# EAGLE design Simon-2021-Giveaway (EAGLE 9.6.2)
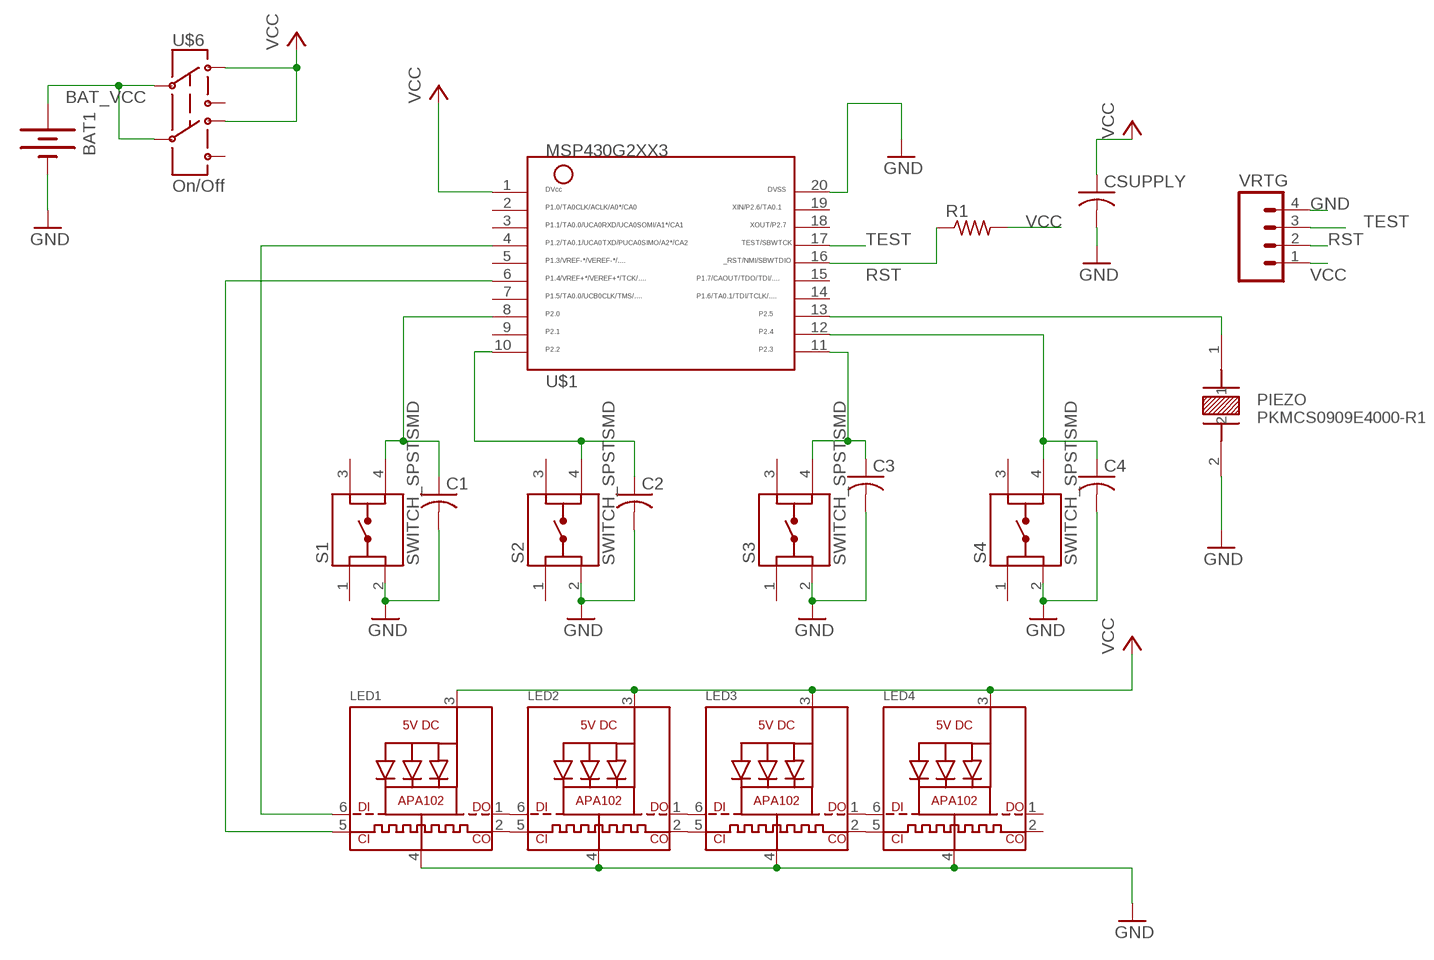
[diagram p0: schematic, sheet 1]

## Parts
BAT1  BATTERY  [BATTERY_PACK_2AA]
C1  C-USC1206  [C1206]
C2  C-USC1206  [C1206]
C3  C-USC1206  [C1206]
C4  C-USC1206  [C1206]
CSUPPLY  C-USC1206  [C1206]
LED1  APA1022020  [APA102_2020]
LED2  APA1022020  [APA102_2020]
LED3  APA1022020  [APA102_2020]
LED4  APA1022020  [APA102_2020]
PIEZO  PKMCS0909E4000-R1  [XDCR_PKMCS0909E4000-R1]
R1  R-US_R1206  [R1206]
S1  SWITCH_SPSTSMD  [SW_1571563-4]
S2  SWITCH_SPSTSMD  [SW_1571563-4]
S3  SWITCH_SPSTSMD  [SW_1571563-4]
S4  SWITCH_SPSTSMD  [SW_1571563-4]
U$1  MSP430G2XX3TSSOP  [PW20]
U$6  On/Off  SWITCH_DPDT  [JS_DPDT_TH]
VRTG  M04LOCK  [1X04_LOCK]

## Nets
BAT_VCC: BAT1.3V(+) U$6.2 U$6.5
CLK: LED1.5(CKI) U$1.6
DATA: LED1.6(DI) U$1.4
GND: BAT1.GND(-) C1.2 C2.2 C3.2 C4.2 CSUPPLY.2 LED1.4(GND) LED2.4(GND) LED3.4(GND) LED4.4(GND) PIEZO.2 S1.2 S2.2 S3.2 S4.2 U$1.20 VRTG.4
N$11: PIEZO.1 U$1.13
N$13: C1.1 S1.4 U$1.8
N$14: C2.1 S2.4 U$1.10
N$15: C3.1 S3.4 U$1.11
N$16: C4.1 S4.4 U$1.12
N$71: LED1.1(DO) LED2.6(DI)
N$72: LED1.2(CKO) LED2.5(CKI)
N$73: LED2.1(DO) LED3.6(DI)
N$74: LED2.2(CKO) LED3.5(CKI)
N$75: LED3.1(DO) LED4.6(DI)
N$76: LED3.2(CKO) LED4.5(CKI)
RST: R1.1 U$1.16 VRTG.2
TEST: U$1.17 VRTG.3
VCC: CSUPPLY.1 LED1.3(VDD) LED2.3(VDD) LED3.3(VDD) LED4.3(VDD) R1.2 U$1.1 U$6.1 U$6.4 VRTG.1
Unconnected: LED4.1(DO) LED4.2(CKO) S1.1 S1.3 S2.1 S2.3 S3.1 S3.3 S4.1 S4.3 U$1.2 U$1.3 U$1.5 U$1.7 U$1.9 U$1.14 U$1.15 U$1.18 U$1.19 U$6.3 U$6.6

## Library data of the parts
BAT1 = ELEC327:BATTERY: Battery Holders Various common sizes : AA, AAA, 20mm coin cell and 12mm coin cell. 20MM_4LEGS, BATT-10373
C1-C4 CSUPPLY = rcl:C-US: CAPACITOR, American symbol
LED1-LED4 = microbuilder:APA102: APA102/DotStar Pixels VCC: 5V DC Refresh Rate: 400Hz
PIEZO = ELEC327:PKMCS0909E4000-R1: Audio Sounder Piezo Solder Pad Surface Mount; DESCRIPTION: Buzzers Transducer, Externally Driven Piezo 1.5V 4kHz 65dB @ 1.5V, 10cm Surface Mount Solder Pads; DIGI-KEY_PART_NUMBER: 490-9647-1-ND; DIGI-KEY_PURCHASE_URL: https://www.digikey.com/product-detail/en/murata-electronics/PKMCS0909E4000-R1/490-9647-1-ND/4878401?utm_source=snapeda&utm_medium=aggregator&utm_campaign=symbol; MF: Murata; MP: PKMCS0909E4000-R1; PACKAGE: 2010 Murata
R1 = resistor:R-US_: RESISTOR, American symbol
S1-S4 = ELEC327:SWITCH_SPST: TE Connectivity Alcoswitch, 6mm Switch Tactile OFF (ON) SPST Round Button PC Pins 0.05A 24VDC 100000Cycles 2.55N Thru-Hole Loose Through Hole Version 1825910-7 <https://www.digikey.com/en/products/detail/te-connectivity-alcoswitch-switches/1825910-7/1731414> Surface Mount Version 1571563-4 <https://www.digikey.com/en/products/detail/te-connectivity-alcoswitch-switches/1571563-4/2400231>
U$1 = ELEC327:MSP430G2XX3: MSP430G2XX3 PDIP (N) 20 Pin Package
U$6 = ELEC327:SWITCH_DPDT
VRTG = SparkFun:M04: Header 4 Standard 4-pin 0.1" header. Use with straight break away headers (SKU : PRT-00116), right angle break away headers (PRT-00553), swiss pins (PRT-00743), machine pins (PRT-00117), and female headers (PRT-00115). Molex polarized connector foot print use with SKU : PRT-08231 with associated crimp pins and housings. 1MM SMD Version SKU: PRT-10208

## Board
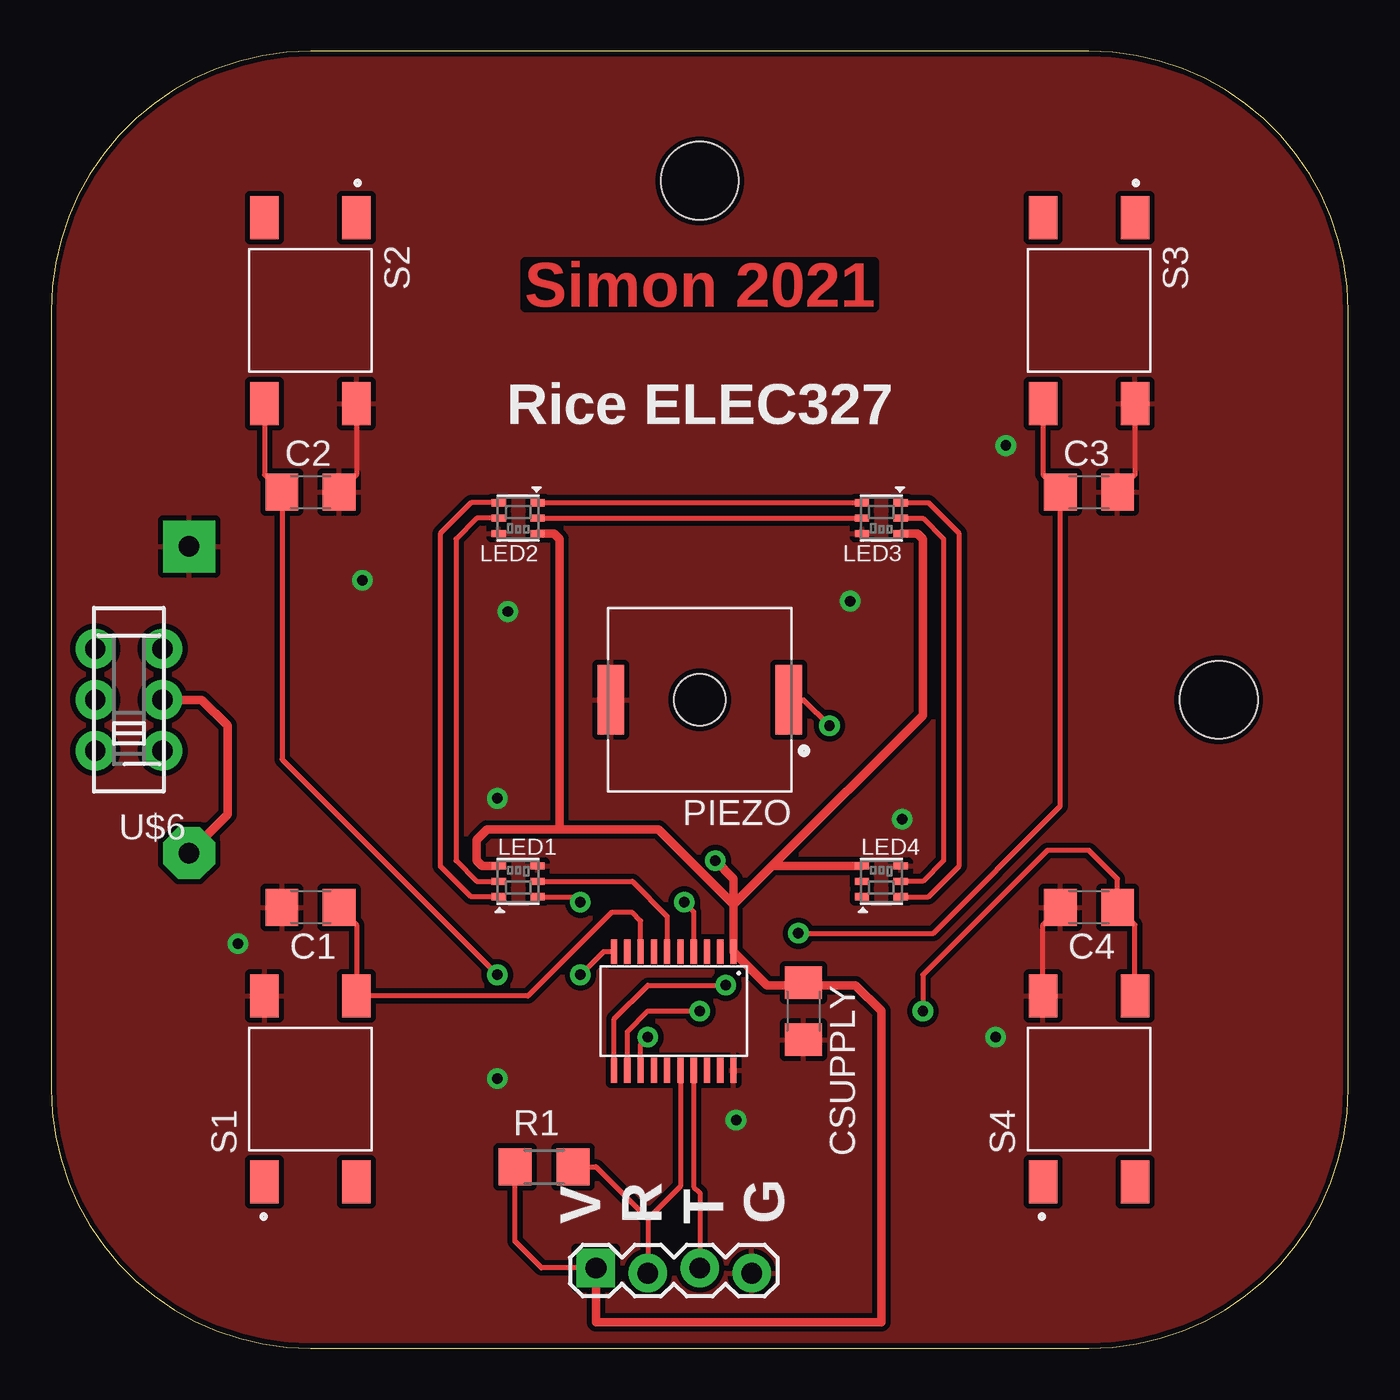
[diagram p1: board, top side]
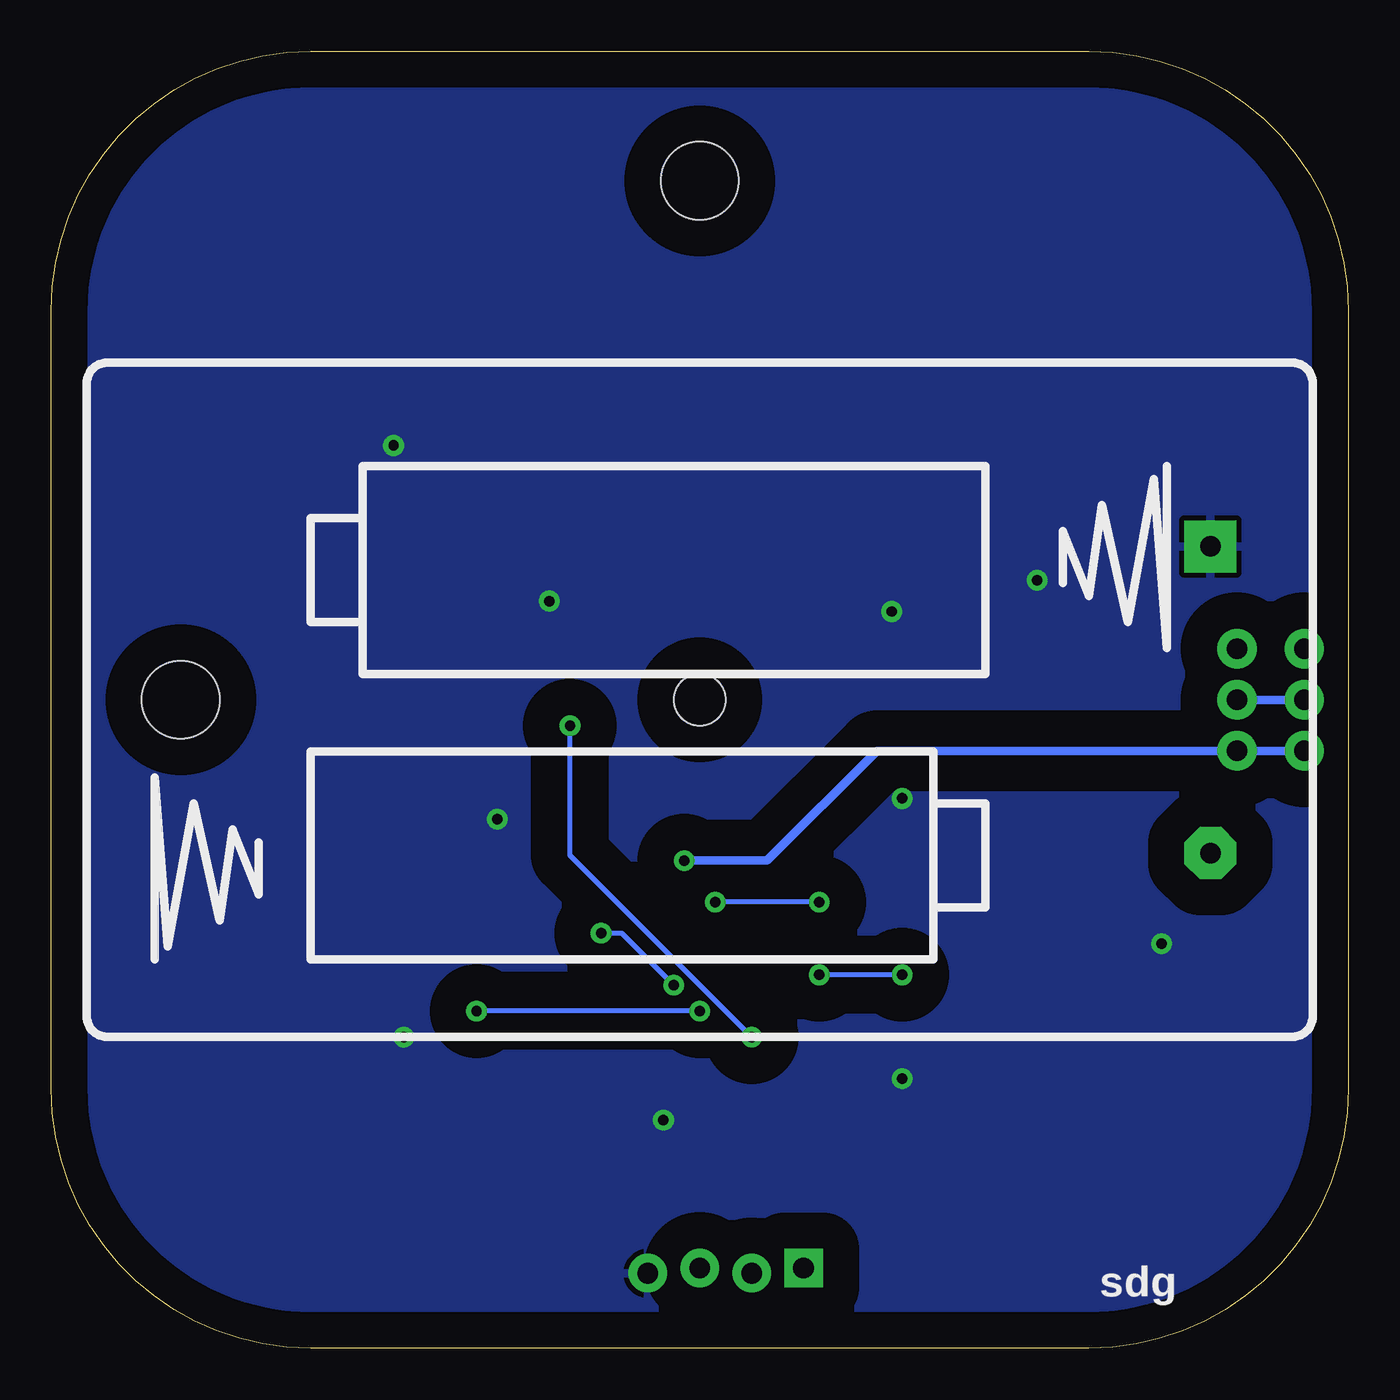
[diagram p2: board, bottom side, seen from below]

Size 63.5 x 63.5 mm. Coordinates in mm from the lower left corner, seen from the top.
Outline: 0,50.8 0,12.7 arc90 12.7,0 50.8,0 arc90 63.5,12.7 63.5,50.8 arc90 50.8,63.5 12.7,63.5 arc90 0,50.8
Copper layers (1*16): Top 0.035mm / dielectric 1.5mm / Bottom 0.035mm
Design rules "AdvancedCircuitsBarebones *": minimum track width 10mil, minimum drill 20mil, track to track 6mil, track to pad 6mil, pad to pad 6mil, via to via 6mil, smd to smd 6mil, copper to edge 10mil, drill to drill 6mil, minimum pad ring 12mil, minimum via ring 10mil, stop-mask expansion 4mil, vias tented up to drill 25mil, thermal gap 10mil
Holes 2.54 mm at 31.75,31.75
Holes 3.81 mm at 31.75,57.15 57.15,31.75

### Footprints (pad centres in the part's own frame; a part is rotated, then mirrored left to right if it is on the bottom)
BATTERY_PACK_2AA = drill 1 pad 2.54 octagon: 3V 7.5,25 | drill 1 pad 2.54 square: GND -7.5,25
C1206 = smd 1.6 x 1.8: 1 -1.4,0; 2 1.4,0
APA102_2020 = smd 0.7 x 0.35: 1 -0.95,-0.75; 2 -0.95,0; 3 -0.95,0.75; 4 0.95,0.75; 5 0.95,0; 6 0.95,-0.75
XDCR_PKMCS0909E4000-R1 = smd 1.3 x 3.4: 1 -4.35,0; 2 4.35,0
R1206 = smd 1.6 x 1.803: 1 -1.422,0; 2 1.422,0
SW_1571563-4 = smd 2.1 x 1.4: 1 -4.55,2.25; 2 4.55,2.25; 3 -4.55,-2.25; 4 4.55,-2.25
PW20 = smd 0.3 x 1.2: 1 -2.925,-2.9; 2 -2.275,-2.9; 3 -1.625,-2.9; 4 -0.975,-2.9; 5 -0.325,-2.9; 6 0.325,-2.9; 7 0.975,-2.9; 8 1.625,-2.9; 9 2.275,-2.9; 10 2.925,-2.9; 11 2.925,2.9; 12 2.275,2.9; 13 1.625,2.9; 14 0.975,2.9; 15 0.325,2.9; 16 -0.325,2.9; 17 -0.975,2.9; 18 -1.625,2.9; 19 -2.275,2.9; 20 -2.925,2.9
JS_DPDT_TH = drill 1 pad 1.93: 1 -2.5,-1.65; 2 0,-1.65; 3 2.5,-1.65; 4 -2.5,1.65; 5 0,1.65; 6 2.5,1.65
1X04_LOCK = drill 1.016 pad 1.88 square: 1 0,0.127 | drill 1.016 pad 1.88: 2 2.54,-0.127; 3 5.08,0.127; 4 7.62,-0.127

### Placement (x,y rotation side)
BAT1  31.75,31.75 270 bottom
C1  12.7,21.59 180 top
C2  12.7,41.91 0 top
C3  50.8,41.91 0 top
C4  50.8,21.59 180 top
CSUPPLY  36.83,16.51 270 top
LED1  22.86,22.86 0 top
LED2  22.86,40.64 180 top
LED3  40.64,40.64 180 top
LED4  40.64,22.86 0 top
PIEZO  31.75,31.75 180 top
R1  24.13,8.89 180 top
S1  12.7,12.7 90 top
S2  12.7,50.8 270 top
S3  50.8,50.8 270 top
S4  50.8,12.7 90 top
U$1  30.48,16.51 180 top
U$6  3.81,31.75 90 top
VRTG  26.67,3.81 0 top

### Tracks (layer width: path | path; a pad name or v marks a point on that pad's centre or on a via)
BAT_VCC
  Top 0.406: BAT1.3V 8.64,26.14 8.64,30.48 7.37,31.75 U$6.2
  Bottom 0.406: U$6.5 U$6.2
CLK
  Top 0.254: U$1.6 30.16,21.15 28.45,22.86 LED1.5
DATA  (via drill 0.51)
  Top 0.254: LED1.6 25.64,22.11 v25.91,21.84 | v30.99,21.84 31.45,21.38 U$1.4
  Bottom 0.254: v25.91,21.84 v30.99,21.84
GND  (via drill 0.51)
  Top 0.254: S2.2 14.95,42.76 C2.2 | S3.2 53.05,42.76 C3.2 | S4.2 48.55,20.74 C4.2
  other vias: 46.74,44.2 15.24,37.59 9.14,19.81 46.23,15.24 22.35,36.07 21.84,26.92 41.66,25.91 39.12,36.58 21.84,13.21 33.53,11.18
  pour Top (isolate 0.254): 0,0 63.5,0 63.5,63.5 0,63.5
  pour Bottom (isolate 1.778): 0,0 63.5,0 63.5,63.5 0,63.5
N$11  (via drill 0.51)
  Top 0.254: U$1.13 28.86,14.88 v29.21,15.24 | PIEZO.1 36.83,31.75 v38.1,30.48
  Bottom 0.254: v29.21,15.24 38.1,24.13 v38.1,30.48
N$13
  Top 0.254: U$1.8 28.86,20.93 28.45,21.34 27.43,21.34 23.35,17.25 S1.4 14.95,20.74 C1.1
N$14  (via drill 0.51)
  Top 0.254: U$1.10 27.03,19.41 v25.91,18.29 | S2.4 10.45,42.76 C2.1 11.3,28.83 v21.84,18.29
  Bottom 0.254: v21.84,18.29 v25.91,18.29
N$15  (via drill 0.51)
  Top 0.254: U$1.11 27.55,16.12 29.21,17.78 v33.02,17.78 | S3.4 48.55,42.76 C3.1 49.4,26.54 43.18,20.32 v36.58,20.32
  Bottom 0.254: v33.02,17.78 35.56,20.32 v36.58,20.32
N$16  (via drill 0.51)
  Top 0.254: U$1.12 28.2,15.51 29.21,16.51 v31.75,16.51 | S4.4 53.05,20.74 C4.1 52.2,22.98 50.8,24.38 48.77,24.38 42.67,18.29 v42.67,16.51
  Bottom 0.254: v31.75,16.51 v42.67,16.51
N$71
  Top 0.254: LED1.1 20.56,22.11 19.05,23.62 19.05,39.88 20.56,41.39 LED2.6
N$72
  Top 0.254: LED1.2 20.83,22.86 19.81,23.88 19.81,39.62 20.83,40.64 LED2.5
N$73
  Top 0.254: LED2.1 LED3.6
N$74
  Top 0.254: LED2.2 LED3.5
N$75
  Top 0.254: LED3.1 42.94,41.39 44.45,39.88 44.45,23.62 42.94,22.11 LED4.6
N$76
  Top 0.254: LED3.2 42.67,40.64 43.69,39.62 43.69,23.88 42.67,22.86 LED4.5
RST
  Top 0.254: U$1.16 30.8,7.95 29.21,6.35 | 29.21,6.35 VRTG.2 | R1.1 26.67,8.89 29.21,6.35
TEST
  Top 0.254: U$1.17 31.45,7.92 31.75,7.62 VRTG.3
VCC  (via drill 0.51)
  Top 0.254: VRTG.1 24,3.94 22.71,5.23 R1.2 | CSUPPLY.1 36.96,17.78
  Top 0.406: VRTG.1 26.67,1.27 40.64,1.27 40.64,16.51 39.37,17.78 36.96,17.78 35.03,17.78 U$1.1 33.41,21.72 | LED4.3 35.29,23.61 | 35.29,23.61 33.41,21.72 | LED1.3 21.09,23.61 20.83,23.88 20.83,24.89 21.34,25.4 24.89,25.4 | 24.89,25.4 29.73,25.4 33.41,21.72 | LED2.3 24.63,39.89 24.89,39.62 24.89,25.4 | LED3.3 42.41,39.89 42.67,39.62 42.67,30.99 35.29,23.61 | 33.41,21.72 33.41,22.98 v32.51,23.88
  Bottom 0.406: v32.51,23.88 28.45,23.88 23.07,29.25 U$6.1 U$6.4

### Text on the board
Top: Simon 2021
tPlace: Rice ELEC327 | V / R / T / G
bPlace: sdg
tStop: Simon 2021